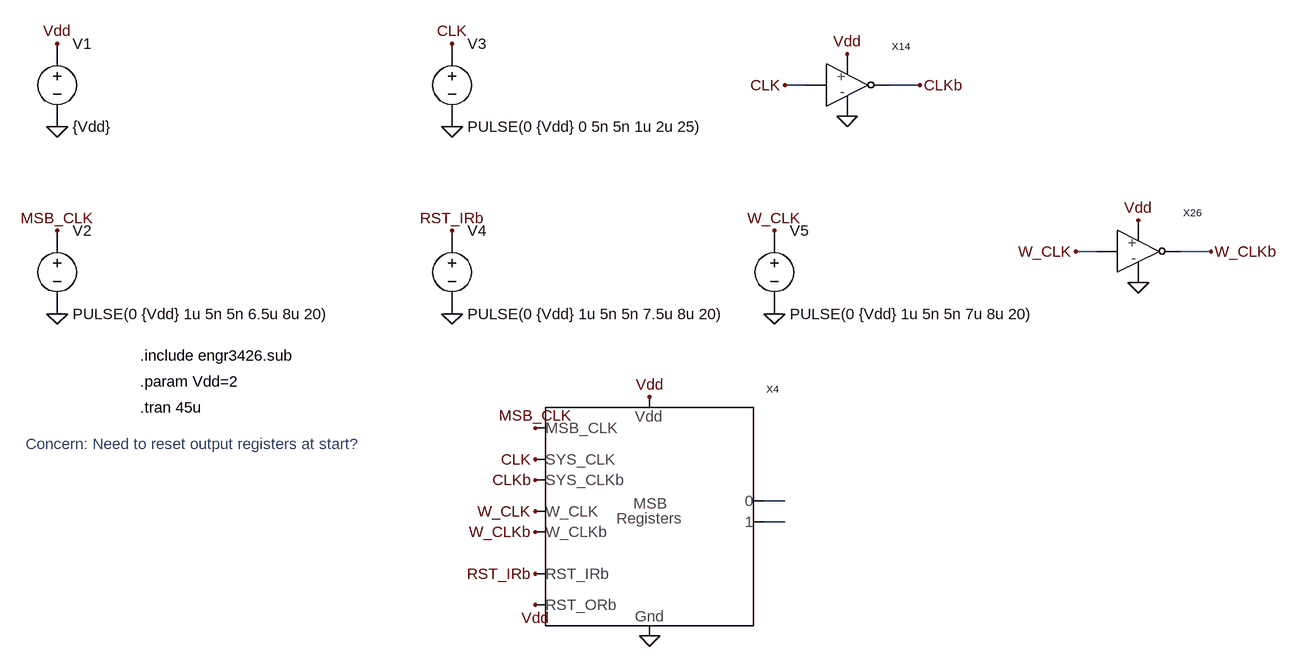
[diagram p0: schematic msb_registers_test.asc]
msb_registers_test.asc, the LTspice schematic file:
Version 4
SHEET 1 2676 1412
WIRE -176 -384 -208 -384
WIRE 0 -384 -48 -384
WIRE 272 -128 240 -128
WIRE 448 -128 400 -128
WIRE -208 256 -240 256
WIRE -208 288 -240 288
FLAG -1328 -320 0
FLAG -1328 -448 Vdd
FLAG -1328 -32 0
FLAG -1328 -160 MSB_CLK
FLAG -720 -320 0
FLAG -720 -448 CLK
FLAG -112 -336 0
FLAG -112 -432 Vdd
FLAG -208 -384 CLK
FLAG 0 -384 CLKb
FLAG -720 -32 0
FLAG -720 -160 RST_IRb
FLAG -224 -32 0
FLAG -224 -160 W_CLK
FLAG 336 -80 0
FLAG 336 -176 Vdd
FLAG 240 -128 W_CLK
FLAG 448 -128 W_CLKb
FLAG -416 96 Vdd
FLAG -416 464 0
FLAG -592 368 RST_IRb
FLAG -592 144 MSB_CLK
FLAG -592 192 CLK
FLAG -592 224 CLKb
FLAG -592 416 Vdd
FLAG -592 272 W_CLK
FLAG -592 304 W_CLKb
SYMBOL cktsym\\vsource -1328 -384 R0
WINDOW 123 0 0 Left 2
WINDOW 39 0 0 Left 2
SYMATTR Value {Vdd}
SYMATTR InstName V1
SYMBOL cktsym\\vsource -1328 -96 R0
WINDOW 123 0 0 Left 2
WINDOW 39 0 0 Left 2
SYMATTR Value PULSE(0 {Vdd} 1u 5n 5n 6.5u 8u 20)
SYMATTR InstName V2
SYMBOL cktsym\\vsource -720 -384 R0
WINDOW 123 0 0 Left 2
WINDOW 39 0 0 Left 2
SYMATTR Value PULSE(0 {Vdd} 0 5n 5n 1u 2u 25)
SYMATTR InstName V3
SYMBOL Inverter -112 -384 R0
SYMATTR InstName X14
SYMATTR SpiceLine nmosL=0.9u nmosW=12u pmosL=0.9u pmosW=24u
SYMBOL cktsym\\vsource -720 -96 R0
WINDOW 123 0 0 Left 2
WINDOW 39 0 0 Left 2
SYMATTR Value PULSE(0 {Vdd} 1u 5n 5n 7.5u 8u 20)
SYMATTR InstName V4
SYMBOL cktsym\\vsource -224 -96 R0
WINDOW 123 0 0 Left 2
WINDOW 39 0 0 Left 2
SYMATTR Value PULSE(0 {Vdd} 1u 5n 5n 7u 8u 20)
SYMATTR InstName V5
SYMBOL Inverter 336 -128 R0
SYMATTR InstName X26
SYMATTR SpiceLine nmosL=0.9u nmosW=12u pmosL=0.9u pmosW=24u
SYMBOL msb_registers -416 272 R0
SYMATTR InstName X4
TEXT -1200 32 Left 2 !.include engr3426.sub
TEXT -1200 72 Left 2 !.param Vdd=2
TEXT -1200 112 Left 2 !.tran 45u
TEXT -1376 168 Left 2 ;Concern: Need to reset output registers at start?

The netlist it stands for:
* msb_registers_test.asc
V1 Vdd 0 {Vdd}
V2 MSB_CLK 0 PULSE(0 {Vdd} 1u 5n 5n 6.5u 8u 20)
V3 CLK 0 PULSE(0 {Vdd} 0 5n 5n 1u 2u 25)
XX14 CLK CLKb Vdd 0 Inverter nmosL=0.9u nmosW=12u pmosL=0.9u pmosW=24u  ; pins IN OUT pos neg
V4 RST_IRb 0 PULSE(0 {Vdd} 1u 5n 5n 7.5u 8u 20)
V5 W_CLK 0 PULSE(0 {Vdd} 1u 5n 5n 7u 8u 20)
XX26 W_CLK W_CLKb Vdd 0 Inverter nmosL=0.9u nmosW=12u pmosL=0.9u pmosW=24u  ; pins IN OUT pos neg
XX4 MSB_CLK CLK CLKb W_CLK W_CLKb RST_IRb Vdd Vdd 0 N001 N002 msb_registers  ; pins MSB_CLK SYS_CLK SYS_CLKb W_CLK W_CLKb RST_IRb RST_ORb pos neg Bit0 Bit1
.include engr3426.sub
.param Vdd=2
.tran 45u
* Concern: Need to reset output registers at start?
.backanno
.end